# Altium schematic sheet 2_ADSTM32-MCU.SchDoc
size A; SheetNumber: 3; SheetTotal: 4
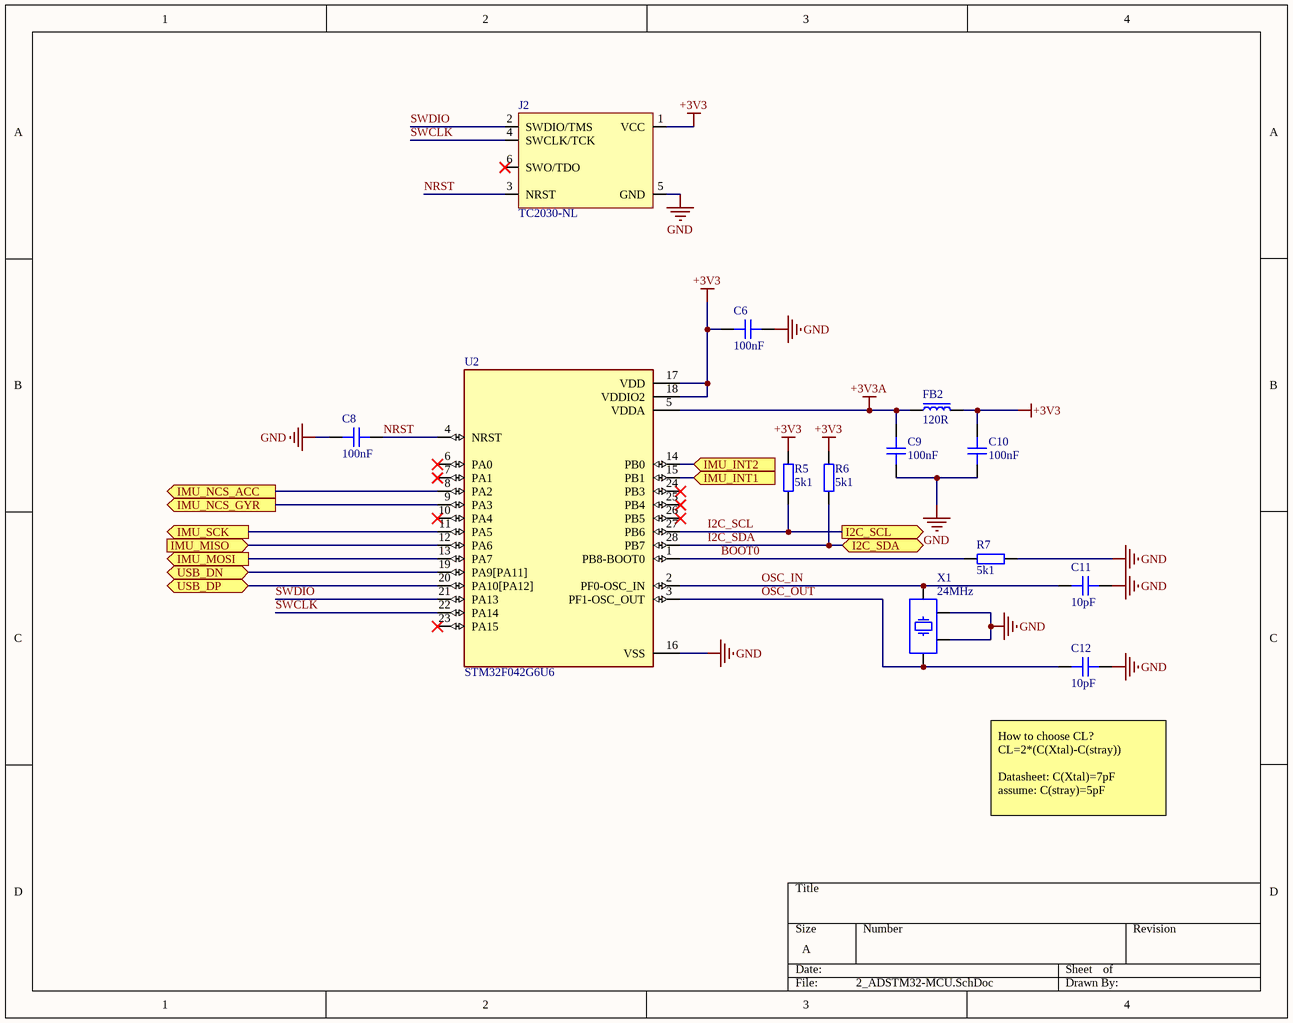
[diagram p0: 2_ADSTM32-MCU.SchDoc]

## Parts
C6  100nF  [CAP_0603]
C8  100nF  [CAP_0603]
C9  100nF  [CAP_0603]
C10  100nF  [CAP_0603]
C11  10pF  [CAP_0603]
C12  10pF  [CAP_0603]
FB2  120R  [FB_0603]
J2  TC2030-NL  [TC2030-NL-FP]  (no BOM)
R5  5k1  [RES_0603]
R6  5k1  [RES_0603]
R7  5k1  [RES_0603]
U2  STM32F042G6U6  [STM32F042G6U6]
X1  24MHz  [XTAL_3225]

## Ports
I2C_SCL (out), I2C_SDA (bidir), IMU_INT1 (in), IMU_INT2 (in), IMU_MISO (in), IMU_MOSI (out), IMU_NCS_ACC (out), IMU_NCS_GYR (out), IMU_SCK (out), USB_DN (bidir), USB_DP (bidir)

## Nets
+3V3: C6.2 C10.2 FB2.2 J2.1(VCC) R5.2 R6.2 U2.17(VDD) U2.18(VDDIO2)
+3V3A: C9.2 FB2.1 U2.5(VDDA)
GND: C6.1 C8.2 C9.1 C10.1 C11.1 C12.1 J2.5(GND) R7.1 U2.16(VSS) X1.2 X1.4
BOOT0: R7.2 U2.1(PB8-BOOT0)
I2C_SCL: R5.1 U2.27(PB6) ; port I2C_SCL
I2C_SDA: R6.1 U2.28(PB7) ; port I2C_SDA
IMU_INT1: U2.15(PB1) ; port IMU_INT1
IMU_INT2: U2.14(PB0) ; port IMU_INT2
IMU_MISO: U2.12(PA6) ; port IMU_MISO
IMU_MOSI: U2.13(PA7) ; port IMU_MOSI
IMU_NCS_ACC: U2.8(PA2) ; port IMU_NCS_ACC
IMU_NCS_GYR: U2.9(PA3) ; port IMU_NCS_GYR
IMU_SCK: U2.11(PA5) ; port IMU_SCK
NRST: C8.1 J2.3(NRST) U2.4(NRST)
OSC_IN: C11.2 U2.2(PF0-OSC_IN) X1.3
OSC_OUT: C12.2 U2.3(PF1-OSC_OUT) X1.1
SWCLK: J2.4(SWCLK/TCK) U2.22(PA14)
SWDIO: J2.2(SWDIO/TMS) U2.21(PA13)
USB_DN: U2.19(PA9[PA11]) ; port USB_DN
USB_DP: U2.20(PA10[PA12]) ; port USB_DP

Not connected (* = marked no-connect by the designer): J2 6(SWO/TDO)*; U2 6(PA0)* 7(PA1)* 10(PA4)* 23(PA15)* 24(PB3)* 25(PB4)* 26(PB5)*

## Notes on the sheet
- How to choose CL?
  CL=2*(C(Xtal)-C(stray))
  Datasheet: C(Xtal)=7pF
  assume: C(stray)=5pF

## Library data of the parts
C6 C8-C12 = CAP_0603: Capacitor SMD 0603; Manufacturer: *; Manufacturer Part Number: *; Distributor Link: *; LCSC: *; Rating: *; Dielectric: *
FB2 = FB_0603: Ferrite Bead SMD 0603; Manufacturer: *; Manufacturer Part Number: *; Distributor Link: *; LCSC: *
J2 = TC2030-NL: Tag-Connect No-Solder SWD Debug Connector (No Legs) DO NOT PLACE; Manufacturer: Tag-Connect; Manufacturer Part Number: TC2030-NL-FP
R5-R7 = RES_0603: Resistor SMD 0603; Manufacturer: *; Manufacturer Part Number: *; Distributor Link: *; LCSC: *
U2 = STM32F042G6U6: ARM® Cortex®-M0 STM32F0 Microcontroller IC 32-Bit Single-Core 48MHz 32KB (32K x 8) FLASH 28-UFQFPN (4x4); Manufacturer: STMicroelectronics; Manufacturer Part Number: STM32F042G6U6
X1 = TSX-3225_24.0000MF15X-AC: Crystal SMD 24MHz 10PPM 7pF 3225; Manufacturer: Epson; Manufacturer Part Number: TSX-3225 24.0000MF15X-AC